# EAGLE design breadboard_usb (EAGLE 6.1)
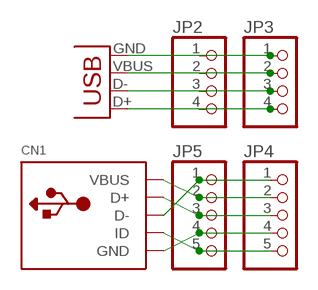
[diagram p0: schematic, sheet 1]

## Parts
CN1  USBTHM  [USB-MINIB-THM]
JP1  USB-B  USBPTH  [USB-B-PTH]
JP2  PINHD-1X4  [1X04]
JP3  PINHD-1X4  [1X04]
JP4  PINHD-1X5  [1X05]
JP5  PINHD-1X5  [1X05]

## Nets
D+: CN1.D+ JP4.3 JP5.3
D-: CN1.D- JP4.1 JP5.1
GND: CN1.GND JP4.4 JP5.4
ID: CN1.ID JP4.5 JP5.5
N$6: JP1.GND JP2.1 JP3.1
N$7: JP1.VBUS JP2.2 JP3.2
N$8: JP1.D- JP2.3 JP3.3
N$9: JP1.D+ JP2.4 JP3.4
VUSB: CN1.VBUS JP4.2 JP5.2

## Library data of the parts
CN1 = adafruit:USB: USB Connectors USBMINIB - Surface Mount Female Mini-B USB Connector 4UConnector: 06564 By microbuilder.eu Thru-hole RA Female Mini-B USB Connector 4UConnector: 18732 By ladyada.net
JP1 = SparkFun-Connectors:USB: USB Connectors USB-B-PTH is fully proven SKU : PRT-00139/CONN-08278 USB-miniB is fully proven SKU : PRT-00587 USB-A-PCB is untested. USB-A-H is throughly reviewed, but untested. Spark Fun Electronics SKU : PRT-00437 USB-B-SMT is throughly reviewed, but untested. Needs silkscreen touching up. USB-A-S has not been used/tested USB-MB-H has not been used/tested USB-MICROB has been used. CONN-09505; PROD_ID: CONN-08278
JP2 JP3 = pinhead:PINHD-1X4: PIN HEADER
JP4 JP5 = pinhead:PINHD-1X5: PIN HEADER

## Board
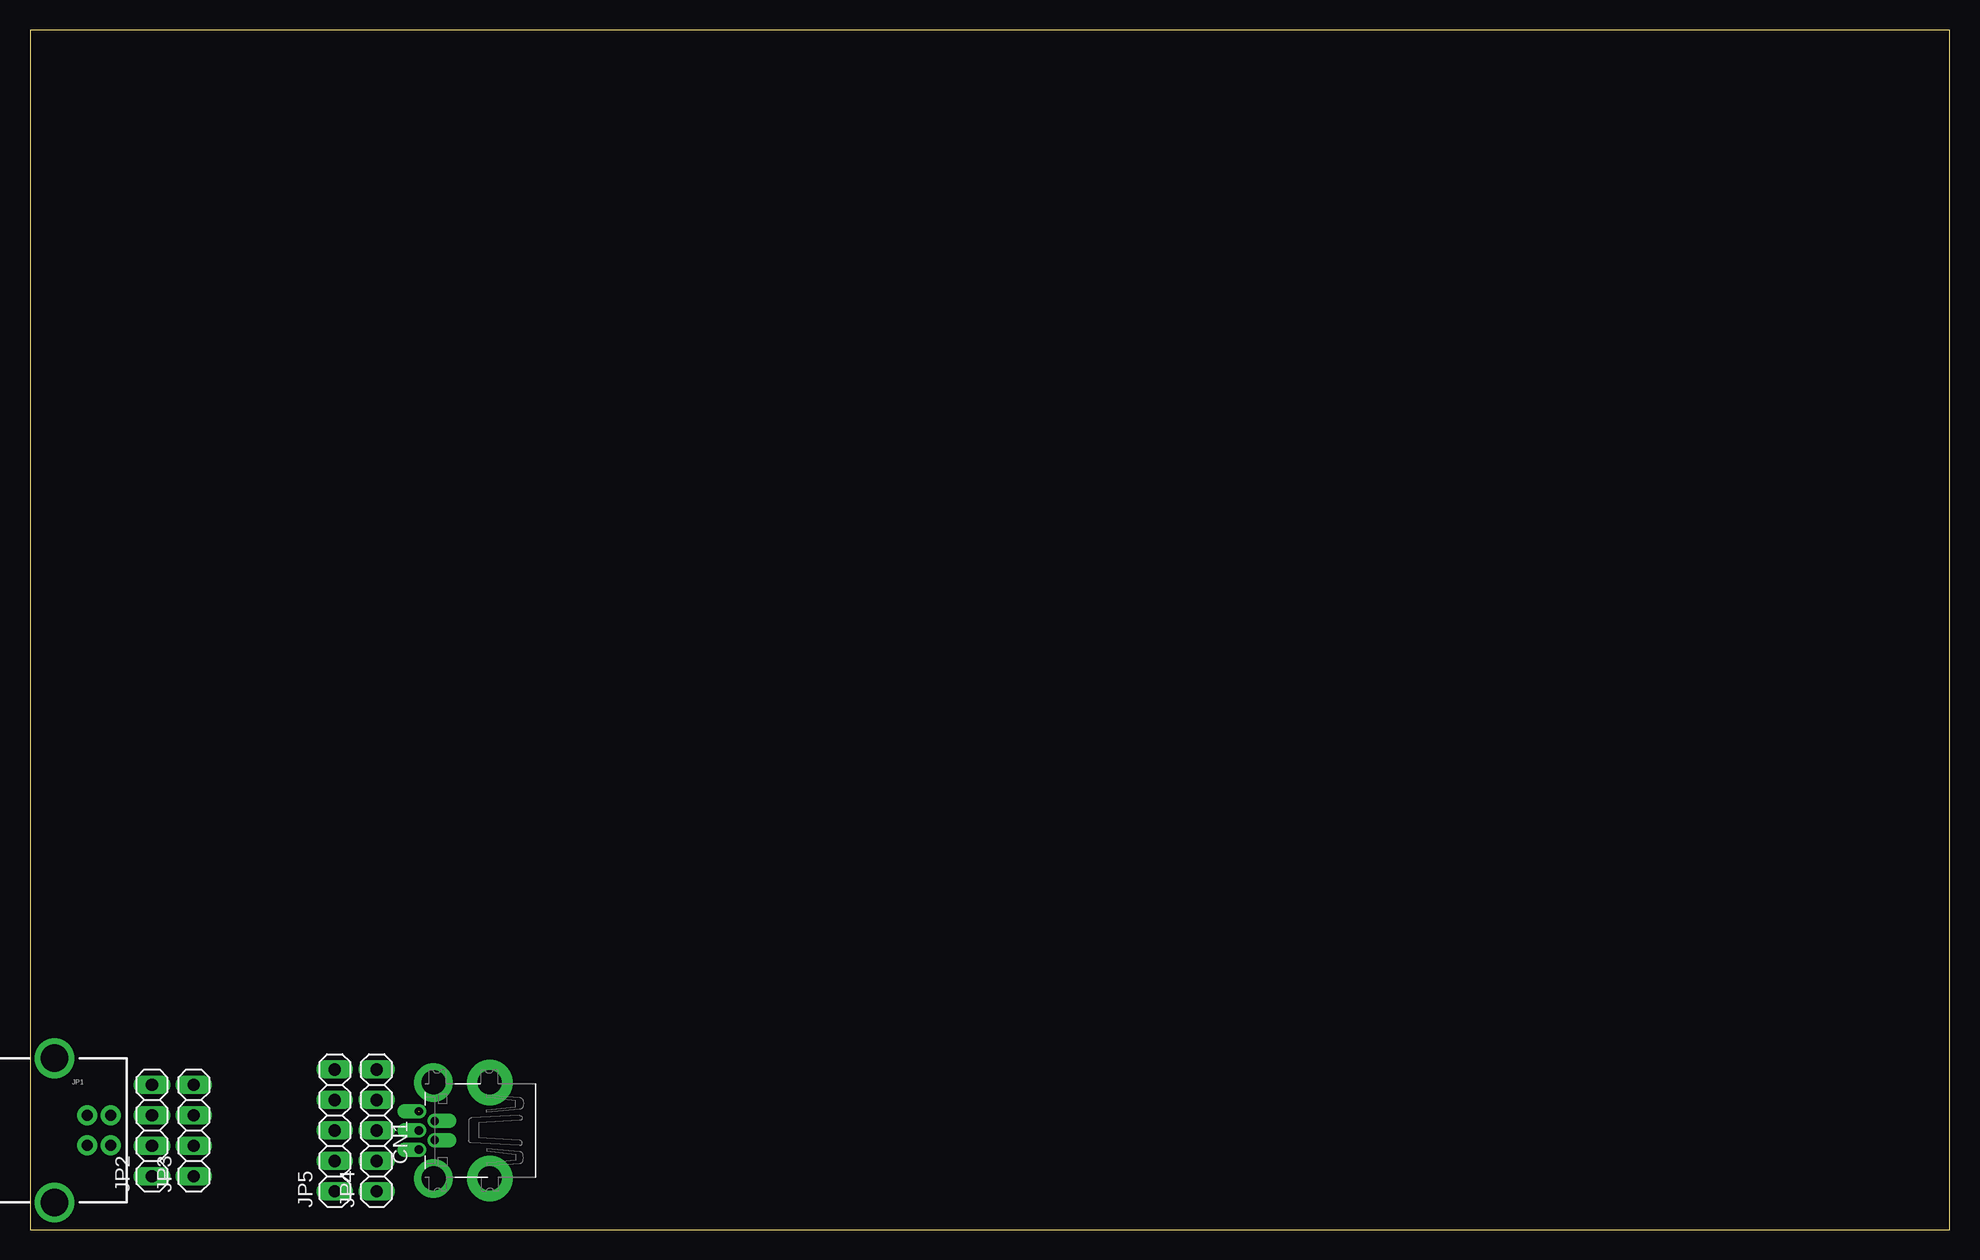
[diagram p1: board, top side]
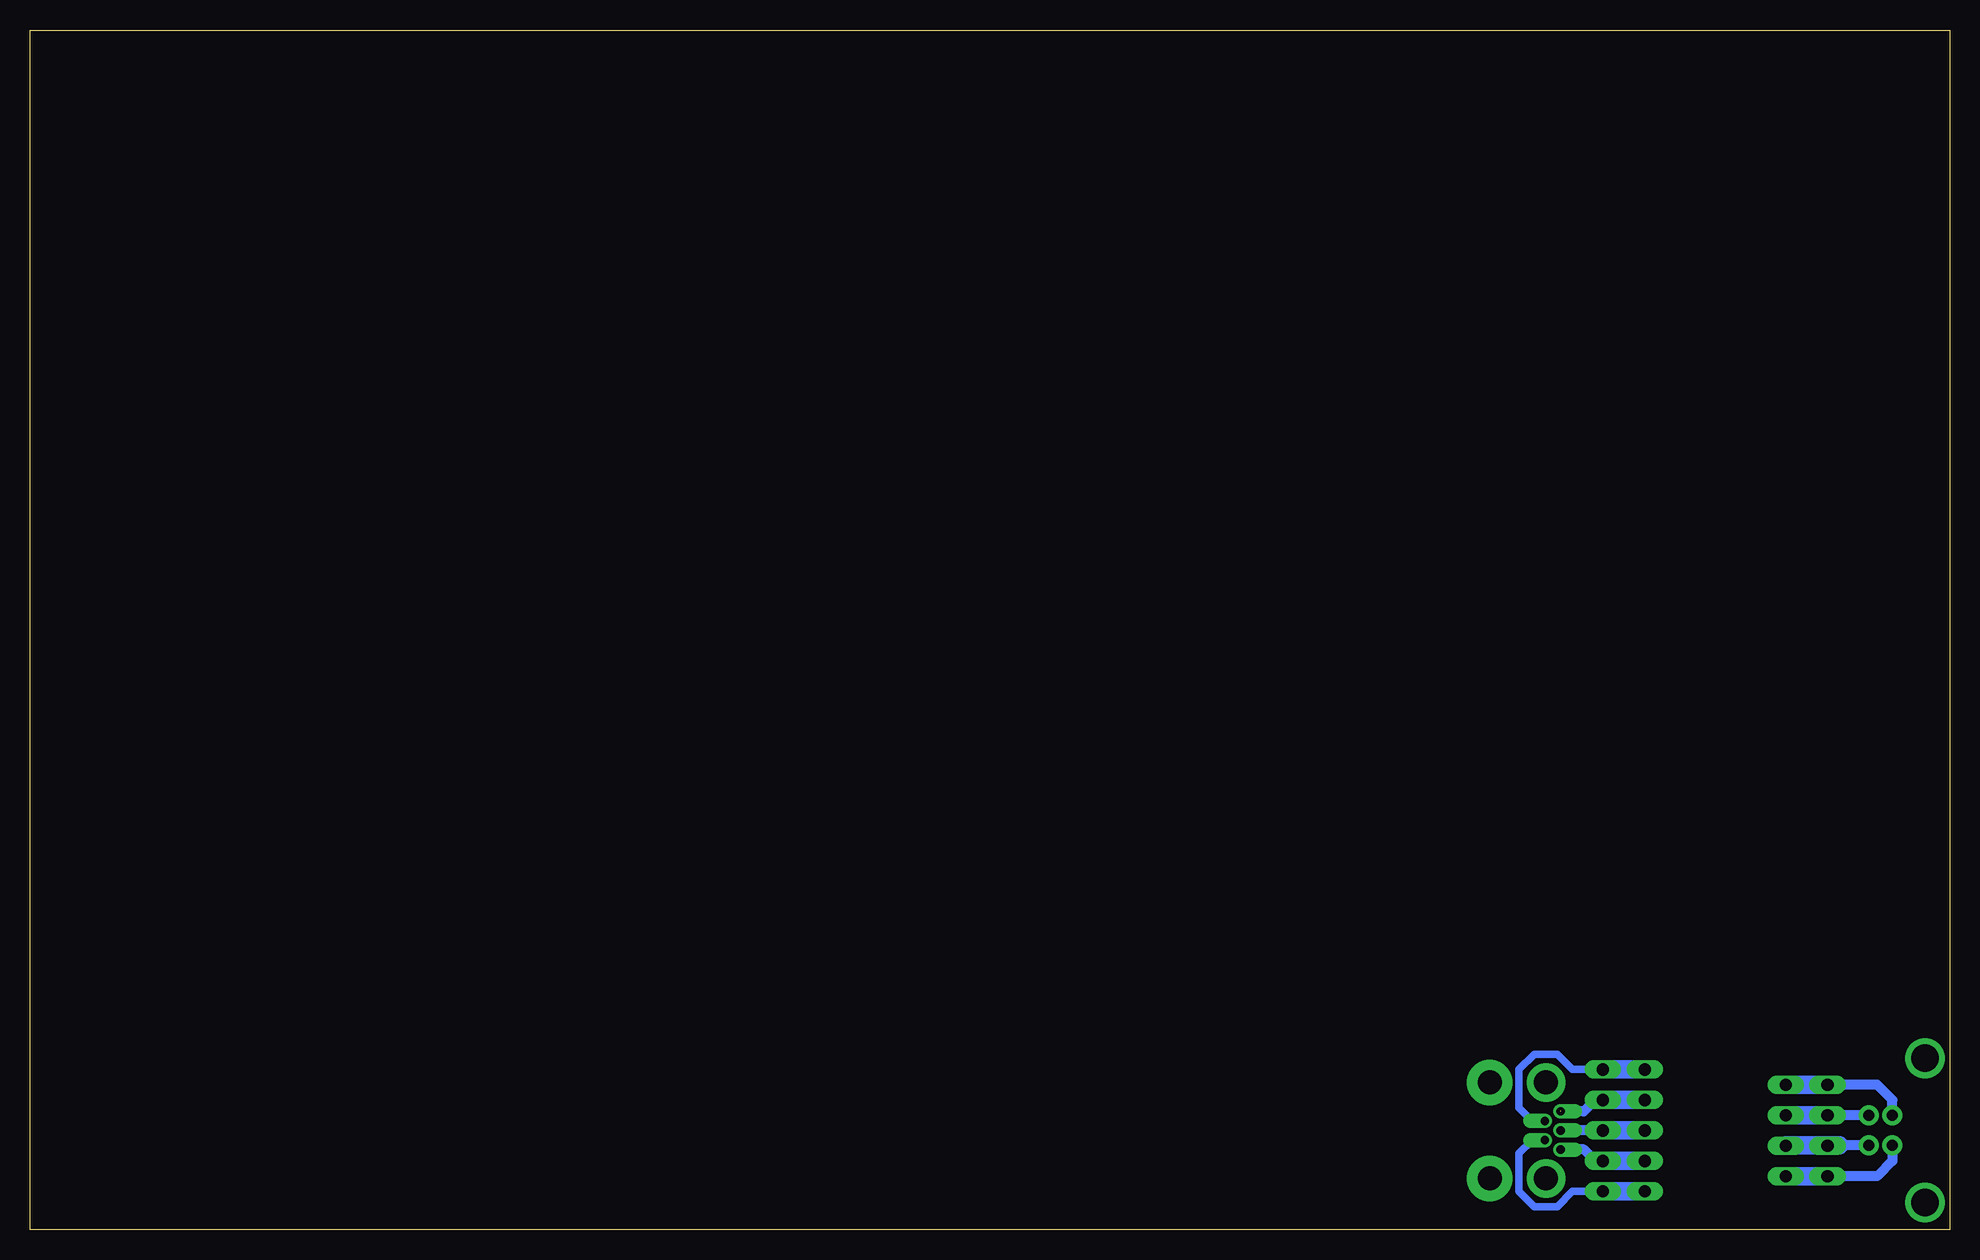
[diagram p2: board, bottom side, seen from below]

Size 160 x 100 mm. Coordinates in mm from the lower left corner, seen from the top.
Outline: 0,0 160,0 160,100 0,100 0,0
Copper layers (1*16): Top 0.035mm / dielectric 1.5mm / Bottom 0.035mm
Design rules: minimum track width 10mil, minimum drill 24mil, track to track 8mil, track to pad 8mil, pad to pad 8mil, via to via 8mil, smd to smd 8mil, copper to edge 40mil, drill to drill 8mil, minimum pad ring 10mil, minimum via ring 8mil, stop-mask expansion 4mil, vias tented up to drill 0mil, thermal gap 10mil

### Footprints (pad centres in the part's own frame; a part is rotated, then mirrored left to right if it is on the bottom)
USB-MINIB-THM = drill 0.7 offset: D+ 0,9.8; D- -0.8,8.5; GND 1.6,9.8; ID 0.8,8.5; VBUS -1.6,9.8 | drill 2 pad 3.81: GND1 -4,3.9; GND4 4,3.9 | drill 2 pad 3.2: GND2 -4,8.6; GND3 4,8.6
USB-B-PTH = drill 0.914 pad 1.676: D+ 0,1.25; D- 1.981,1.25; GND 0,-1.25; VBUS 1.981,-1.25 | drill 2.286: S1 -2.718,-6.02; S2 -2.718,6.02
1X04 = drill 1.016 long: 1 -3.81,0; 2 -1.27,0; 3 1.27,0; 4 3.81,0
1X05 = drill 1.016 long: 1 -5.08,0; 2 -2.54,0; 3 0,0; 4 2.54,0; 5 5.08,0

### Placement (x,y rotation side)
CN1  42.23,8.26 90 top
JP1  4.76,8.26 0 top
JP2  10.16,8.26 90 top
JP3  13.65,8.26 90 top
JP4  28.89,8.26 90 top
JP5  25.4,8.26 90 top

### Tracks (layer width: path | path; a pad name or v marks a point on that pad's centre or on a via)
D+
  Bottom 0.813: JP4.3 CN1.D+
  Bottom 1.524: JP4.3 JP5.3
D-
  Bottom 0.61: JP4.1 31.43,3.17 32.7,1.91 34.61,1.91 35.88,3.17 35.88,6.35 34.77,7.46 CN1.D-
  Bottom 1.524: JP4.1 JP5.1
GND  (1 unrouted)
  Bottom 0.813: JP4.4 29.53,10.79 30.48,9.84 32.38,9.84 | 32.41,9.84 CN1.GND
  Bottom 1.524: JP5.4 JP4.4
ID
  Bottom 0.61: JP4.5 31.43,13.34 32.7,14.61 34.61,14.61 35.88,13.34 35.88,10.16 34.92,9.21 33.88,9.21 CN1.ID
  Bottom 1.524: JP4.5 JP5.5
N$6
  Bottom 0.813: JP1.GND 4.76,5.71 6.03,4.45 JP2.1
  Bottom 1.524: JP2.1 JP3.1
N$7
  Bottom 0.813: JP1.VBUS 9.21,7 9.21,6.99 JP2.2
  Bottom 1.524: 9.21,7 13.65,7 JP3.2
N$8
  Bottom 0.813: JP1.D- 10.16,9.51 JP2.3
  Bottom 1.524: JP3.3 JP2.3
N$9
  Bottom 0.813: JP1.D+ 4.76,10.79 6.03,12.06 JP2.4
  Bottom 1.524: JP2.4 JP3.4
VUSB
  Bottom 0.813: JP4.2 29.53,5.71 30.48,6.67 32.41,6.67 CN1.VBUS
  Bottom 1.524: JP5.2 JP4.2